# EAGLE design flight_computer (EAGLE 9.6.2)
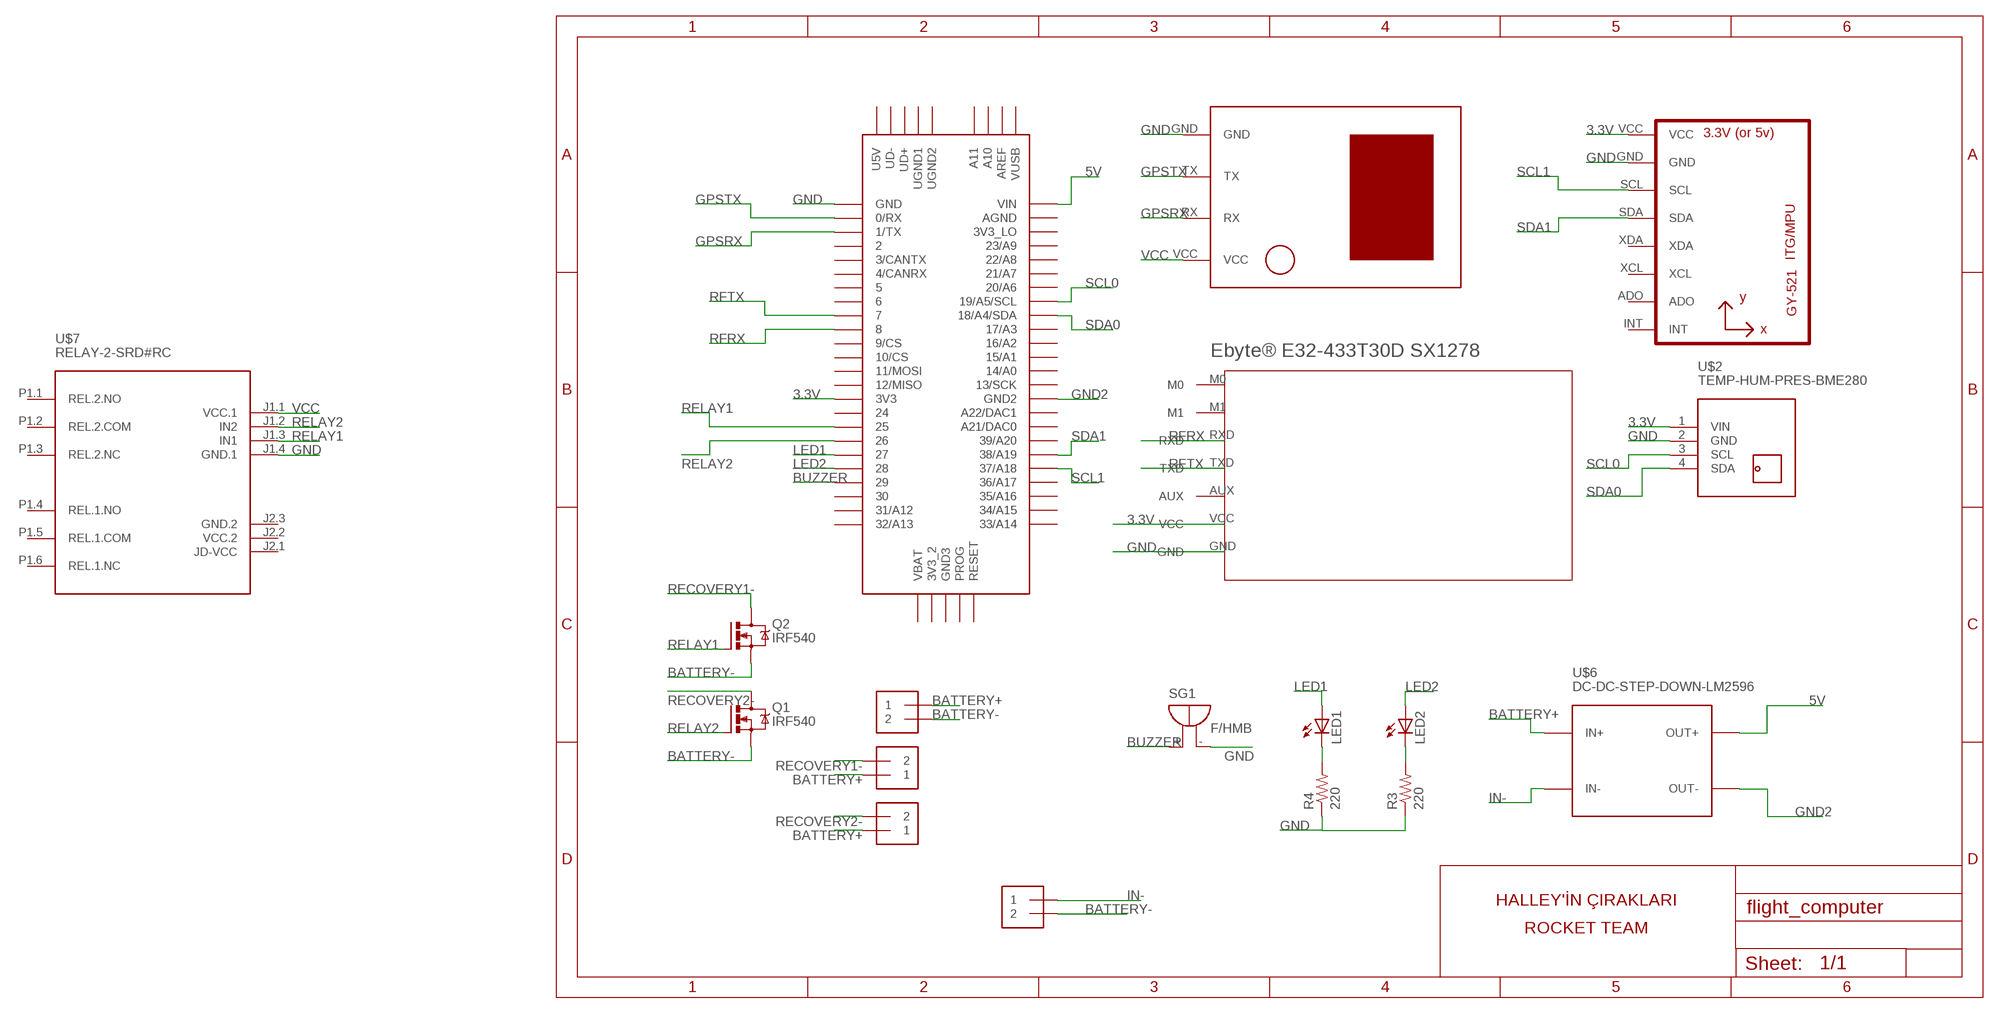
[diagram p0: schematic, sheet 1]

## Parts
J1  1X2-3.5MM  [1X2-3.5MM]
J2  1X2-3.5MM  [1X2-3.5MM]
J3  1X2-3.5MM  [1X2-3.5MM]
J4  1X2-3.5MM  [1X2-3.5MM]
LED1  LED5MM  [LED5MM]
LED2  LED5MM  [LED5MM]
Q1  IRF540  NMOSFET_IRF540-TO220  [TO220BV]
Q2  IRF540  NMOSFET_IRF540-TO220  [TO220BV]
R3  220  R-US_0204/7  [0204/7]
R4  220  R-US_0204/7  [0204/7]
SG1  F/HMB  [F/HMB]
U1  GY-521MPU6050  [GY-521]
U$1  U-BLOX-NEO6V2  [U-BLOX-NEO6V2]
U$2  TEMP-HUM-PRES-BME280  [TEMP-HUM-PRES-BME280]
U$3  TEENSY_3.5/3.6  [TEENSY_3.5/3.6]
U$4  EBYTE®E32-433T30DSX1278  [E32-433T30D]
U$6  DC-DC-STEP-DOWN-LM2596  [DC-DC-STEP-DOWN-LM2596]
U$7  RELAY-2-SRD#RC  [RELAY-2-SRD#RC]

## Nets
3.3V: U1.VCC U$2.1(VIN) U$3.3V3 U$4.VCC
5V: U$3.VIN U$6.OUT+
BATTERY+: J1.1 J2.1 J3.1 U$6.IN+
BATTERY-: J1.2 J4.2 Q1.S Q2.S
BUZZER: SG1.+ U$3.29
GND: R3.1 R4.1 SG1.- U1.GND U$1.GND U$2.2(GND) U$3.GND U$4.GND U$7.J1.4(GND.1)
GND2: U$3.GND2 U$6.OUT-
GPSRX: U$1.RX U$3.1/TX
GPSTX: U$1.TX U$3.0/RX
IN-: J4.1 U$6.IN-
LED1: LED1.A U$3.27
LED2: LED2.A U$3.28
N$1: LED1.K(C) R4.2
N$2: LED2.K(C) R3.2
RECOVERY1-: J2.2 Q2.D
RECOVERY2-: J3.2 Q1.D
RELAY1: Q2.G U$3.25 U$7.J1.3(IN1)
RELAY2: Q1.G U$3.26 U$7.J1.2(IN2)
RFRX: U$3.8 U$4.RXD
RFTX: U$3.7 U$4.TXD
SCL0: U$2.3(SCL) U$3.19/A5/SCL
SCL1: U1.SCL U$3.37/A18
SDA0: U$2.4(SDA) U$3.18/A4/SDA
SDA1: U1.SDA U$3.38/A19
VCC: U$1.VCC U$7.J1.1(VCC.1)
Unconnected: U1.ADO U1.INT U1.XCL U1.XDA U$3.2 U$3.3/CANTX U$3.3V3_2 U$3.3V3_LO U$3.4/CANRX U$3.5 U$3.6 U$3.9/CS U$3.10/CS U$3.11/MOSI U$3.12/MISO U$3.13/SCK U$3.14/A0 U$3.15/A1 U$3.16/A2 U$3.17/A3 U$3.20/A6 U$3.21/A7 U$3.21/DAC0(A21/DAC0) U$3.22/A8 U$3.23/A9 U$3.24 U$3.30 U$3.31/A12 U$3.32/A13 U$3.33/A14 U$3.34/A15 U$3.35/A16 U$3.36/A17 U$3.39/A20 U$3.A10 U$3.A11 U$3.A22/DAC1 U$3.AGND U$3.AREF U$3.GND3 U$3.PROG U$3.RESET U$3.U5V U$3.UD+ U$3.UD- U$3.UGND1 U$3.UGND2 U$3.VBAT U$3.VUSB U$4.AUX U$4.M0 U$4.M1 U$7.J2.1(JD-VCC) U$7.P1.1(REL.2.NO) U$7.P1.2(REL.2.COM) U$7.P1.3(REL.2.NC) U$7.P1.4(REL.1.NO) U$7.P1.5(REL.1.COM) U$7.P1.6(REL.1.NC)

## Notes on the sheet
- HALLEY'İN ÇIRAKLARI
- ROCKET TEAM

## Power pins joined to a net without a drawn wire
GND.2: U$7.J2.3(GND.2)
VCC.2: U$7.J2.2(VCC.2)

## Library data of the parts
J1-J4 = adafruit:1X2: 3.5mm Terminal block http://www.ladyada.net/library/pcb/eaglelibrary.html
LED1 LED2 = adafruit:LED: LED OSRAM: - CHIPLED LG R971, LG N971, LY N971, LG Q971, LY Q971, LO R971, LY R971 LH N974, LH R974 LS Q976, LO Q976, LY Q976 LO Q996 - Hyper CHIPLED LW Q18S LB Q993, LB Q99A, LB R99A - SideLED LS A670, LO A670, LY A670, LG A670, LP A670 LB A673, LV A673, LT A673, LW A673 LH A674 LY A675 LS A676, LA A676, LO A676, LY A676, LW A676 LS A679, LY A679, LG A679 - Hyper Micro SIDELED® LS Y876, LA Y876, LO Y876, LY Y876 LT Y87S - SmartLED LW L88C, LW L88S LB L89C, LB L89S, LG L890 LS L89K, LO L89K, LY L89K LS L896, LA L896, LO L896, LY L896 - TOPLED LS T670, LO T670, LY T670, LG T670, LP T670 LSG T670, LSP T670, LSY T670, LOP T670, LYG T670 LG T671, LOG T671, LSG T671 LB T673, LV T673, LT T673, LW T673 LH T674 LS T676, LA T676, LO T676, LY T676, LB T676, LH T676, LSB T676, LW T676 LB T67C, LV T67C, LT T67C, LS T67K, LO T67K, LY T67K, LW E67C LS E67B, LA E67B, LO E67B, LY E67B, LB E67C, LV E67C, LT E67C LW T67C LS T679, LY T679, LG T679 LS T770, LO T770, LY T770, LG T770, LP T770 LB T773, LV T773, LT T773, LW T773 LH T774 LS E675, LA E675, LY E675, LS T675 LS T776, LA T776, LO T776, LY T776, LB T776 LHGB T686 LT T68C, LB T68C - Hyper Mini TOPLED® LB M676 - Mini TOPLED Santana® LG M470 LS M47K, LO M47K, LY M47K Source: http://www.osram.convergy.de/
Q1 Q2 = Transistor:NMOSFET_: N-Channel MOSFET - Popular parts; CATEGORY: Transistor; DESCRIPTION: MOSFET N-CH 100V 33A TO-220AB; DRAIN_CURRENT: 33A; MANUFACTURER: Infineon Technologies; MPN: IRF540NPBF; OPERATING_TEMP: -55°C ~ 175°C; PART_STATUS: Active; ROHS_COMPLIANT: Yes; SUB-CATEGORY: MOSFET; THERMALLOSS: 130W; TYPE: N-Channel
R3 R4 = adafruit:R-US_: RESISTOR, American symbol
SG1 = buzzer:F/HMB: BUZZER Source: Buerklin; OC_FARNELL: unknown; OC_NEWARK: unknown
U1 = gy-521:GY-521
U$1 = u-blox neo-6m v2:U-BLOX-NEO6V2
U$2 = diy-modules:TEMP-HUM-PRES-BME280: Digital Humidity-Temperature-Pressure Sensor based on BME280 device More information about BME280 device is available here: https://www.bosch-sensortec.com/bst/products/all_products/bme280 Click here to find device on ebay.com <http://www.ebay.com/sch/bme280+breakout>
U$3 = Teensy356:TEENSY_3.5/3.6
U$4 = Ebyte_E32-433T30D_SX1278:EBYTE®E32-433T30DSX1278
U$6 = diy-modules:DC-DC-STEP-DOWN-LM2596: DC/DC Step-Down Regulator based on LM2596-ADJ chip LM2596 datasheet available here: http://www.ti.com/lit/ds/symlink/lm2596.pdf Click here to find device on ebay.com <http://www.ebay.com/sch/lm2596+power+regulator>
U$7 = diy-modules:RELAY-2-SRD#RC: 2-Channel Relay Module based on SRD-05VDC-SL-C relays Symbol with relays pins Click here to find device on ebay.com <http://www.ebay.com/sch/two+channel+relay+module+optocoupler+5v>

## Board
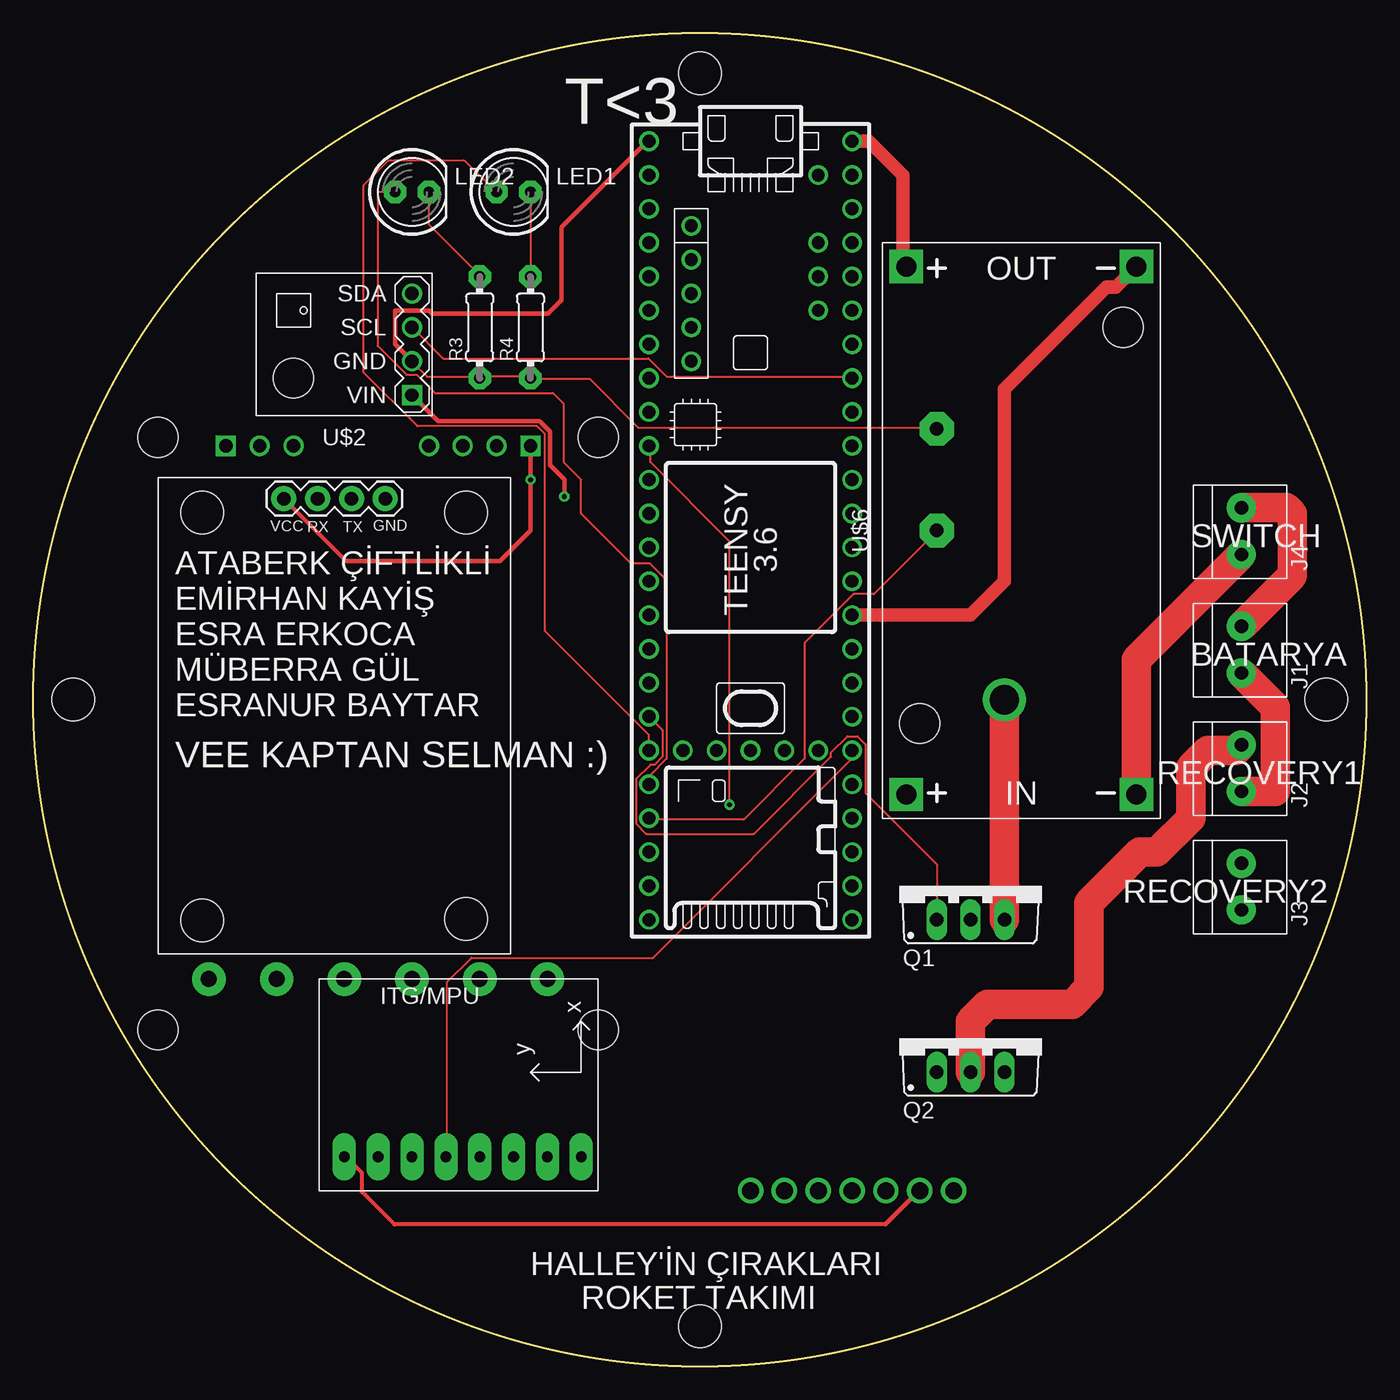
[diagram p1: board, top side]
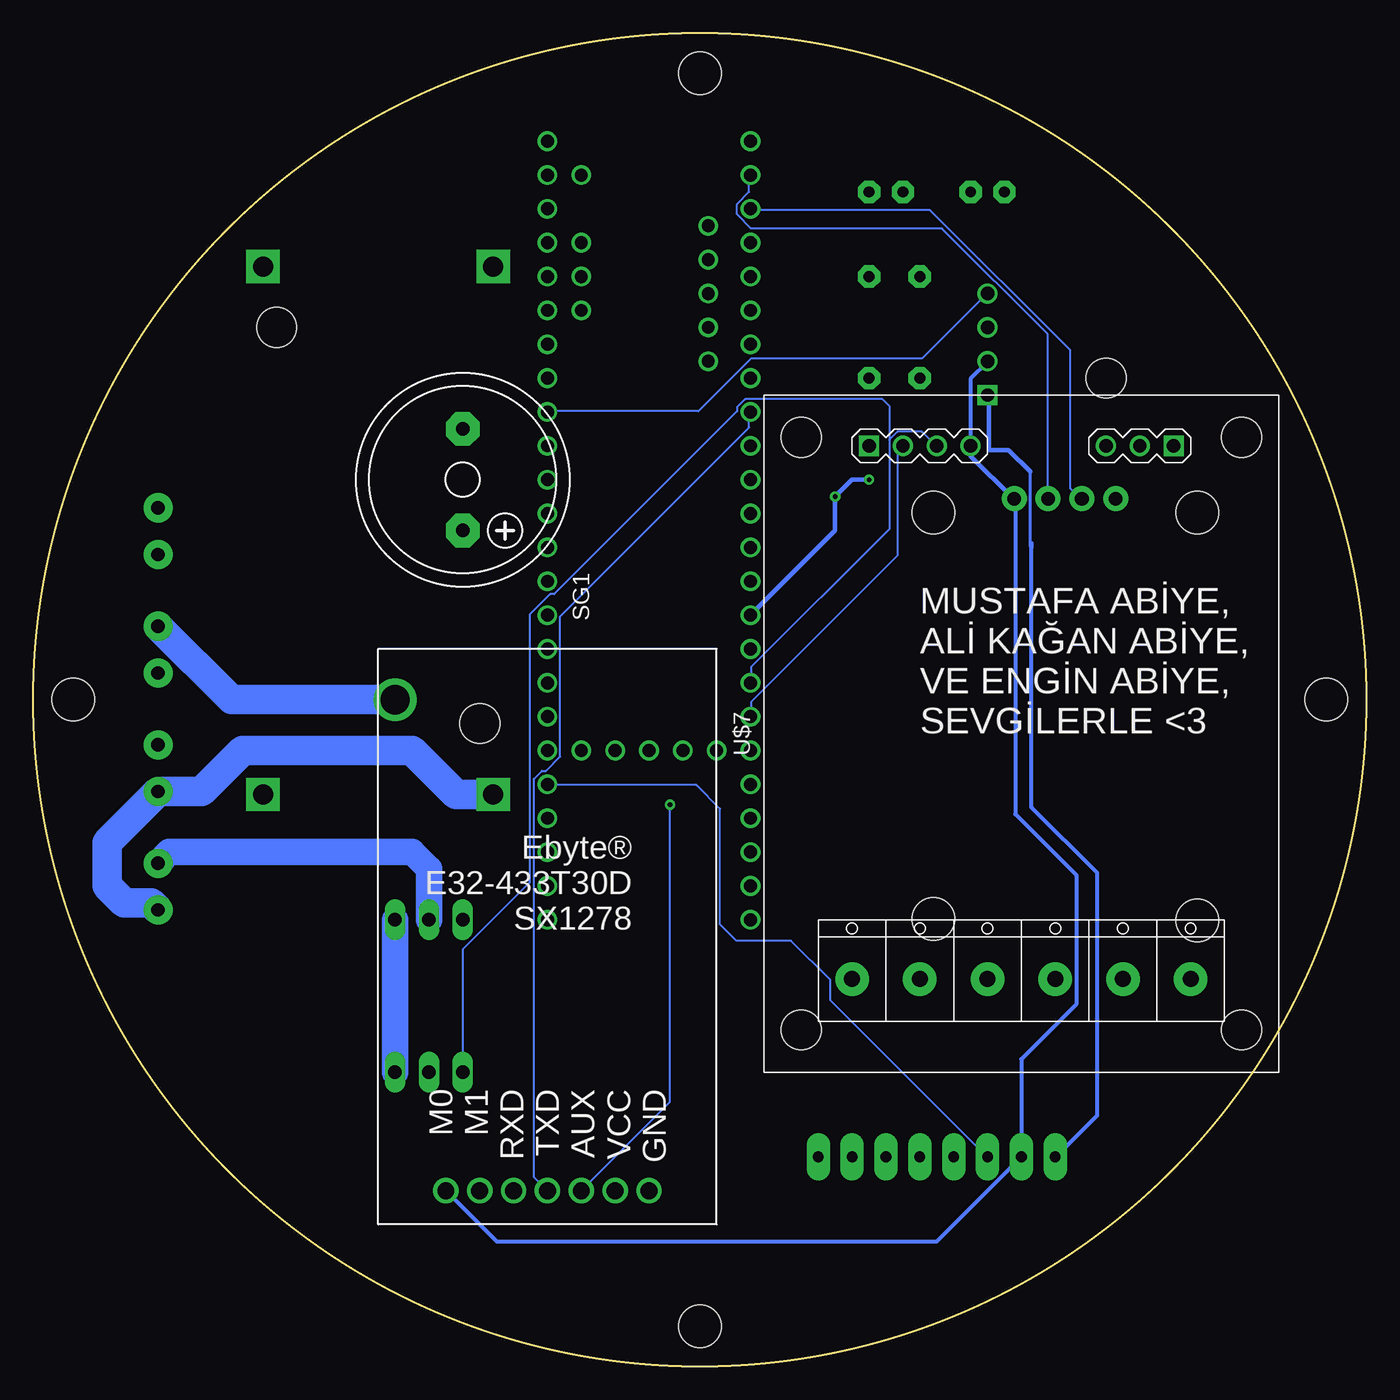
[diagram p2: board, bottom side, seen from below]

Size 100 x 100 mm. Coordinates in mm from the lower left corner, seen from the top.
Outline: circle at 50,50 radius 50
Copper layers (1*16): Top 0.035mm / dielectric 1.5mm / Bottom 0.035mm
Design rules "default": minimum track width 6mil, minimum drill 0.35mm, track to track 6mil, track to pad 6mil, pad to pad 6mil, via to via 6mil, smd to smd 6mil, copper to edge 40mil, drill to drill 6mil, minimum pad ring 10mil, minimum via ring 8mil, stop-mask expansion 4mil, vias tented up to drill 0mil, thermal gap 10mil
Holes 3.2 mm at 50,96.99 3.01,50 96.99,50 50,3.01

### Footprints (pad centres in the part's own frame; a part is rotated, then mirrored left to right if it is on the bottom)
1X2-3.5MM = drill 1 pad 2.184: 1 1.8,0; 2 -1.7,0
LED5MM = drill 0.813 pad 1.676 octagon: A -1.27,0; K 1.27,0
TO220BV = drill 1.016 long: D 0,-2.54; G -2.54,-2.54; S 2.54,-2.54
0204/7 = drill 0.813 pad 1.676 octagon: 1 -3.81,0; 2 3.81,0
F/HMB = drill 1.016 pad 2.54 octagon: + 3.81,0; - -3.81,0
GY-521 = drill 0.8 pad 1.778 long: ADO -8.89,-6.35; GND -8.89,6.35; INT -8.89,-8.89; SCL -8.89,3.81; SDA -8.89,1.27; VCC -8.89,8.89; XCL -8.89,-3.81; XDA -8.89,-1.27
U-BLOX-NEO6V2 = drill 1.016 pad 1.88: GND 17.05,34.13; RX 11.97,34.13; TX 14.51,34.13; VCC 9.43,34.13 | hole 3.2: 3.3,33.1; 23.1,33.1; 3.3,2.5; 23.1,2.6
TEMP-HUM-PRES-BME280 = drill 1 square: 1 -5.08,3.81 | drill 1: 2 -5.08,1.27; 3 -5.08,-1.27; 4 -5.08,-3.81 | hole 3: 3.81,2.54
TEENSY_3.5/3.6 = drill 0.965: 0/RX -25.4,-7.62; 1/TX -22.86,-7.62; 2 -20.32,-7.62; 3/CANTX -17.78,-7.62; 3V3 7.62,-7.62; 3V3_2 17.78,-2.54; 3V3_LO -22.86,7.62; 4/CANRX -15.24,-7.62; 5 -12.7,-7.62; 6 -10.16,-7.62; 7 -7.62,-7.62; 8 -5.08,-7.62; 9/CS -2.54,-7.62; 10/CS 0,-7.62; 11/MOSI 2.54,-7.62; 12/MISO 5.08,-7.62; 13/SCK 5.08,7.62; 14/A0 2.54,7.62; 15/A1 0,7.62; 16/A2 -2.54,7.62; 17/A3 -5.08,7.62; 18/A4/SDA -7.62,7.62; 19/A5/SCL -10.16,7.62; 20/A6 -12.7,7.62; 21/A7 -15.24,7.62; 21/DAC0 12.7,7.62; 22/A8 -17.78,7.62; 23/A9 -20.32,7.62; 24 10.16,-7.62; 25 12.7,-7.62; 26 15.24,-7.62; 27 17.78,-7.62; 28 20.32,-7.62; 29 22.86,-7.62; 30 25.4,-7.62; 31/A12 27.94,-7.62; 32/A13 30.48,-7.62; 33/A14 30.48,7.62; 34/A15 27.94,7.62; 35/A16 25.4,7.62; 36/A17 22.86,7.62; 37/A18 20.32,7.62; 38/A19 17.78,7.62; 39/A20 15.24,7.62; A10 -17.78,5.08; A11 -15.24,5.08; A22/DAC1 10.16,7.62; AGND -25.4,7.62; AREF -20.32,5.08; GND -27.94,-7.62; GND2 7.62,7.62; GND3 17.78,0; PROG 17.78,2.54; RESET 17.78,5.08; U5V -21.59,-4.445; UD+ -16.51,-4.445; UD- -19.05,-4.445; UGND1 -13.97,-4.445; UGND2 -11.43,-4.445; VBAT 17.78,-5.08; VIN -27.94,7.62; VUSB -25.4,5.08
E32-433T30D = drill 1.27: AUX 10.16,-1.27; GND 15.24,-1.27; M0 0,-1.27; M1 2.54,-1.27; RXD 5.08,-1.27; TXD 7.62,-1.27; VCC 12.7,-1.27
DC-DC-STEP-DOWN-LM2596 = drill 1.5 pad 2.5 square: IN+ -19.812,8.636; IN- -19.812,-8.636; OUT+ 19.812,8.636; OUT- 19.812,-8.636 | hole 3: -14.478,7.62; 15.24,-7.62
RELAY-2-SRD#RC = drill 1 square: J1.1 21.59,11.43; J2.1 21.59,-11.43 | drill 1: J1.2 21.59,8.89; J1.3 21.59,6.35; J1.4 21.59,3.81; J2.2 21.59,-8.89; J2.3 21.59,-6.35 | drill 1.2 pad 2.5: P1.1 -18.415,12.7; P1.2 -18.415,7.62; P1.3 -18.415,2.54; P1.4 -18.415,-2.54; P1.5 -18.415,-7.62; P1.6 -18.415,-12.7 | hole 3: -22.225,16.51; 22.225,16.51; 22.225,-16.51; -22.225,-16.51

### Placement (x,y rotation side)
J1  90.64,53.81 270 top
J2  90.64,44.92 270 top
J3  90.64,36.03 270 top
J4  90.64,62.7 270 top
LED1  36.03,88.1 0 top
LED2  28.41,88.1 0 top
Q1  70.32,36.03 0 top
Q2  70.32,24.6 0 top
R3  33.49,77.94 90 top
R4  37.3,77.94 90 top
SG1  67.78,66.51 270 bottom
U1  32.22,24.6 90 top
U$1  9.36,30.95 0 top
U$2  23.33,76.67 180 top
U$3  53.81,63.97 270 top
U$4  53.81,11.9 180 bottom
U$6  74.13,62.7 90 top
U$7  25.87,47.46 90 bottom

### Tracks (layer width: path | path; a pad name or v marks a point on that pad's centre or on a via)
3.3V  (via drill 0.35)
  Top 0.152: 28.46,72.86 U$2.1 | 23.43,15.71 U1.VCC | 66.41,13.12 U$4.VCC
  Top 0.3: 23.43,15.71 24.65,14.49 24.65,13.07 27.09,10.63 63.92,10.63
  Top 0.33: v39.84,65.24 39.84,66.51 38.76,67.59 38.76,70.13 38.57,70.32 37.97,70.92 30.35,70.92 U$2.1
  Top 0.34: 66.41,13.12 63.92,10.63
  Bottom 0.152: 28.31,72.86 U$2.1 | 23.28,15.71 U1.VCC
  Bottom 0.22: 25.19,61.52 25.19,67.1
  Bottom 0.25: 25.11,61.43 25.19,61.52
  Bottom 0.3: 25.11,61.73 25.11,61.43 25.11,41.92 20.18,36.99 20.18,18.81 23.28,15.71
  Bottom 0.33: 28.31,72.86 28.31,68.75 26.84,68.75 25.19,67.1 | U$3.3V3 39.84,62.7 v39.84,65.24
5V
  Top 1: U$6.OUT+ 65.24,82.77 65.24,89.37 62.7,91.91 U$3.VIN
BATTERY+
  Top 2.2: J1.1 93.18,49.47 93.18,43.12 J2.1
  Bottom 2.2: J3.1 91.17,34.76 93.18,34.76 94.45,36.03 94.45,39.31 J2.1 87.36,43.12 84.29,46.19 71.59,46.19 68.29,42.89 U$6.IN+
BATTERY-  (via drill 2.2)
  Top 0.152: 72.05,32.78 Q1.S
  Top 2.2: J4.2 94.02,64.4 94.45,63.97 94.45,59.32 J1.2 | v72.86,50 Q1.S
  Bottom 2: Q1.S Q2.S
  Bottom 2.2: J1.2 85.13,50 v72.86,50
BUZZER
  Top 0.152: U$3.29 46.29,41.01 53.3,41.01 57.87,45.58 57.87,54.27 61.53,57.92 63.06,57.92 67.78,62.65 SG1.+
GND
  Top 0.152: 33.49,74.23 37.3,74.23 R4.1 37.3,74.08 41.72,74.08 45.38,70.42 67.78,70.42 SG1.- | U$3.GND 46.09,91.91 | 28.31,75.45 U$2.2 28.46,75.3 29.53,74.23 33.49,74.23 | 33.49,74.23 R3.1
  Top 0.33: 46.09,91.91 39.64,85.46 39.64,80.48 39.64,79.97 38.62,78.96 29.93,78.96 29.68,79.21 27.14,79.21 27.14,76.67 U$2.2
  Bottom 0.152: 29.68,68.29 U$7.J1.4 | 26.48,65.09 U$1.GND 26.33,64.94 | 28.46,75.3 U$2.2
  Bottom 0.3: U$4.GND 65.24,9.36 32.22,9.36 U1.GND 25.87,23.02 21.76,27.14 21.76,36.84 26.33,41.41 26.33,64.94 | U$7.J1.4 29.68,74.08 28.46,75.3
  Bottom 0.33: 26.48,65.09 29.68,68.29
GND2
  Top 1: U$6.OUT- 81.21,80.96 80.5,80.96 72.86,73.31 72.86,58.89 70.32,56.35 U$3.GND2
GPSRX
  Bottom 0.152: U$3.1/TX 46.14,86.73 32.73,86.73 22.21,76.21 22.21,65.85 21.45,65.09 U$1.RX
GPSTX
  Bottom 0.152: U$3.0/RX 46.29,89.32 46.29,88.1 47.21,87.19 47.21,86.42 46.14,85.36 31.81,85.36 23.89,77.43 23.89,65.09 U$1.TX
IN-
  Top 2.2: U$6.IN- 82.77,53.03 J4.1
LED1
  Top 0.152: U$3.27 46.14,46.19 46.14,47.41 38.37,55.18 38.37,69.96 37.81,70.52 28.82,70.52 24.75,74.59 24.75,88.56 26.63,90.44 32.37,90.44 34.71,88.1 LED1.A
LED2
  Top 0.152: 46.27,60.24 47.51,58.99 47.51,45.58 46.29,44.36 46.29,43.75 U$3.28 | 38.98,73.01 30.14,73.01 28.77,74.38 28,74.38 25.82,76.57 25.82,88.1 LED2.A
  Top 0.16: 38.98,73.01 39.78,72.2 39.78,67.84 41.11,66.51 41.11,63.97 44.84,60.24 46.27,60.24
N$1
  Top 0.152: LED1.K R4.2
N$2
  Top 0.152: LED2.K 29.68,85.66 33.49,81.85 R3.2
RECOVERY1-
  Top 0.152: Q2.D 70.32,21.09
  Top 2.2: J2.2 90.21,46.19 88.1,46.19 86.83,44.92 86.83,41.11 84.29,38.57 83.02,38.57 79.21,34.76 79.21,28.41 77.94,27.14 71.59,27.14 70.32,25.87 Q2.D
RECOVERY2-
  Bottom 2: Q1.D 70.32,37.3 71.59,38.57 89.8,38.57 J3.2
RELAY1
  Bottom 0.152: 35.78,69.51 35.78,72.05 36.28,72.56 46.6,72.56 47.21,71.95 47.21,71.64 60.92,57.92 61.23,57.92 62.75,56.4 62.75,36.28 67.78,31.25 Q2.G | 35.78,69.51 35.78,62.8 46.14,52.44 46.14,51.37 U$3.25 | 35.78,69.51 35.17,70.12 33.34,70.12 32.27,69.05 U$7.J1.3
RELAY2
  Top 0.152: Q1.G 67.78,37.66 62.45,42.99 62.45,46.65 61.84,47.26 61.07,47.26 59.85,46.04 59.85,45.73 54.06,39.94 45.99,39.94 45.23,40.7 45.23,44.06 46.29,45.12 46.6,45.12 47.21,45.73 47.21,47.71 U$3.26
  Bottom 0.152: U$3.26 46.14,48.78 46.14,49.85 35.17,60.82 35.17,68.75 34.86,69.05 U$7.J1.2
RFRX  (via drill 0.35)
  Top 0.152: v52.23,42.13 52.23,61.89 46.29,67.83 46.29,69.05 U$3.8
  Bottom 0.152: v52.23,42.13 52.23,19.82 U$4.RXD
RFTX
  Bottom 0.152: U$4.TXD 62.45,14.19 62.45,44.06 61.84,44.67 61.53,44.67 60.47,45.73 60.47,56.25 46.29,70.42 46.29,71.49 U$3.7
SCL0
  Top 0.152: U$2.3 30.75,75.6 46.14,75.6 47.51,74.23 61.38,74.23 U$3.19/A5/SCL
SCL1
  Bottom 0.152: U$3.37/A18 61.38,43.6 50.25,43.6 48.48,41.82 48.48,33.13 47.26,31.91 43.14,31.91 40.2,28.97 40.2,27.45 28.46,15.71 U1.SCL
SDA0
  Bottom 0.152: U$3.18/A4/SDA 61.38,71.64 50.1,71.64 46.14,75.6 33.34,75.6 28.46,80.48 U$2.4
SDA1
  Top 0.152: U$3.38/A19 61.43,45.58 46.49,30.64 32.88,30.64 31.05,28.82 31.05,15.71 U1.SDA
VCC  (via drill 0.35)
  Top 0.152: 18.86,65.09 U$1.VCC
  Top 0.3: U$1.VCC 23.46,60.41
  Top 0.33: 23.46,60.41 35.01,60.41 37.3,62.7 v37.3,66.51 U$7.J1.1
  Bottom 0.33: v37.3,66.51 38.57,66.51 39.84,65.24

### Text on the board
tNames: T<3 | SWITCH | BATARYA | ATABERK ÇİFTLİKLİ / EMİRHAN KAYİŞ / ESRA ERKOCA / MÜBERRA GÜL / ESRANUR BAYTAR | VEE KAPTAN SELMAN :) | RECOVERY1 | RECOVERY2 | HALLEY'İN ÇIRAKLARI | ROKET TAKIMI
bNames: MUSTAFA ABİYE, / ALİ KAĞAN ABİYE, / VE ENGİN ABİYE, / SEVGİLERLE <3